# EAGLE design senseBox-MCU_mini_v11 (EAGLE 7.7.0)

## Sheet 1 of 3
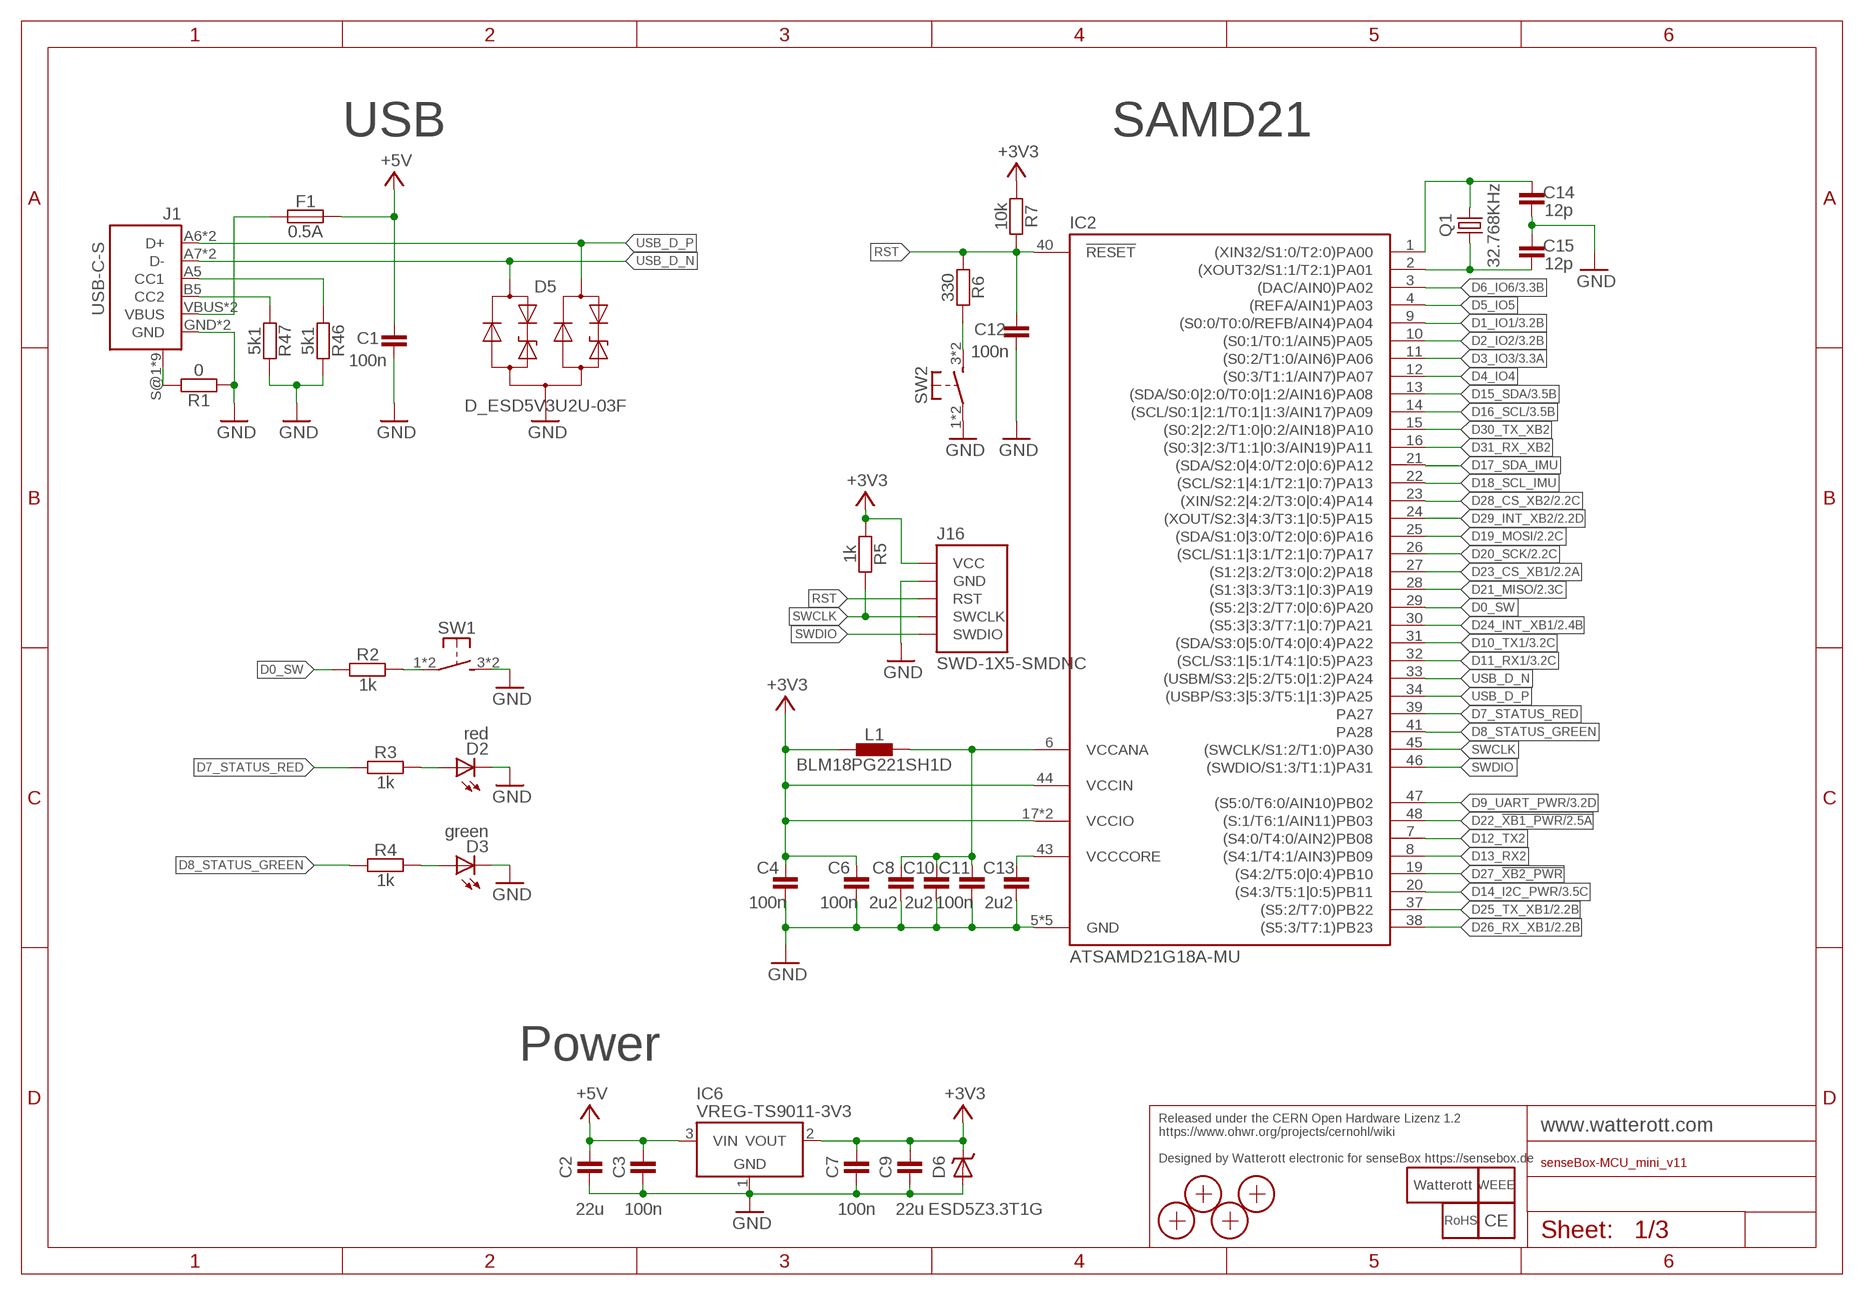
[diagram p0: schematic, sheet 1]

### Parts
C1  100n  CAPACITOR-0402  [C0402]
C2  22u  CAPACITOR-0805  [C0805]
C3  100n  CAPACITOR-0402  [C0402]
C4  100n  CAPACITOR-0402  [C0402]
C6  100n  CAPACITOR-0402  [C0402]
C7  100n  CAPACITOR-0402  [C0402]
C8  2u2  CAPACITOR-0402  [C0402]
C9  22u  CAPACITOR-0805  [C0805]
C10  2u2  CAPACITOR-0402  [C0402]
C11  100n  CAPACITOR-0402  [C0402]
C12  100n  CAPACITOR-0402  [C0402]
C13  2u2  CAPACITOR-0402  [C0402]
C14  12p  CAPACITOR-0402  [C0402]
C15  12p  CAPACITOR-0402  [C0402]
D2  red  LED-0603  [C0603]
D3  green  LED-0603  [C0603]
D5  D_ESD5V3U2U-03F  [SOT723]
D6  ESD5Z3.3T1G  D_TVS-SOD523  [SOD523]
F1  0.5A  FUSE-0805  [C0805]
IC2  ATSAMD21G18A-MU  [QFN48-PAD]
IC6  VREG-TS9011-3V3  [SOT23]
J1  USB-C-S  [USB-C-S]
J16  SWD-1X5-SMDNC  [SWD-1X5_SMDNC]
L1  BLM18PG221SH1D  INDUCTOR-0603  [C0603]
LOGO4  LOGO_SPARK-4  [SPARK_4MM]
LOGO5  LOGO_ROHS-2  [ROHS_2MM]
LOGO6  LOGO_WEEE-4  [WEEE_4MM]
LOGO7  LOGO_CE-2  [CE_2MM]
Q1  32.768KHz  CRYSTAL-ZM315  [CRYSTAL_ZM315]
R1  0  RESISTOR-0402  [C0402]
R2  1k  RESISTOR-0402  [C0402]
R3  1k  RESISTOR-0402  [C0402]
R4  1k  RESISTOR-0402  [C0402]
R5  1k  RESISTOR-0402  [C0402]
R6  330  RESISTOR-0402  [C0402]
R7  10k  RESISTOR-0402  [C0402]
R46  5k1  RESISTOR-0402  [C0402]
R47  5k1  RESISTOR-0402  [C0402]
SW1  PTS645SH50SMTR92-Grey  SW-TACTILE-PTS840P  [PTS840P]
SW2  PTS645SK50SMTR92-Red  SW-TACTILE-PTS840P  [PTS840P]
X1  PASSER-07  [PASSER_07MM]
X2  PASSER-07  [PASSER_07MM]
X3  PASSER-07  [PASSER_07MM]
X4  PASSER-07  [PASSER_07MM]

### Nets
+3V3: C4.2 C6.2 C7.2 C9.2 D6.C IC2.17(VCCIO) IC2.36(VCCIO) IC2.44(VCCIN) IC6.2(VOUT) J16.1-VCC(VCC) L1.1 R5.1 R7.1 ; also sheet 2,3
+5V: C1.2 C2.2 C3.2 F1.2 IC6.3(VIN) ; also sheet 3
CC1: J1.A5(CC1) R46.1
CC2: J1.B5(CC2) R47.1
D0_SW: IC2.29((S5:2|3:2/T7:0|0:6)PA20) R2.1
D1_IO1: IC2.9((S0:0/T0:0/REFB/AIN4)PA04) ; also sheet 3
D2_IO2: IC2.10((S0:1/T0:1/AIN5)PA05) ; also sheet 3
D3_IO3: IC2.11((S0:2/T1:0/AIN6)PA06) ; also sheet 3
D4_IO4: IC2.12((S0:3/T1:1/AIN7)PA07)
D5_IO5: IC2.4((REFA/AIN1)PA03)
D6_IO6: IC2.3((DAC/AIN0)PA02) ; also sheet 3
D7_STATUS_RED: IC2.39(PA27) R3.1
D8_STATUS_GREEN: IC2.41(PA28) R4.1
D9_UART_PWR: IC2.47((S5:0/T6:0/AIN10)PB02) ; also sheet 3
D10_TX1: IC2.31((SDA/S3:0|5:0/T4:0|0:4)PA22) ; also sheet 3
D11_RX1: IC2.32((SCL/S3:1|5:1/T4:1|0:5)PA23) ; also sheet 3
D12_TX2: IC2.7((S4:0/T4:0/AIN2)PB08)
D13_RX2: IC2.8((S4:1/T4:1/AIN3)PB09)
D14_I2C_PWR: IC2.20((S4:3/T5:1|0:5)PB11) ; also sheet 3
D15_SDA: IC2.13((SDA/S0:0|2:0/T0:0|1:2/AIN16)PA08) ; also sheet 3
D16_SCL: IC2.14((SCL/S0:1|2:1/T0:1|1:3/AIN17)PA09) ; also sheet 3
D17_SDA_IMU: IC2.21((SDA/S2:0|4:0/T2:0|0:6)PA12)
D18_SCL_IMU: IC2.22((SCL/S2:1|4:1/T2:1|0:7)PA13)
D19_MOSI: IC2.25((SDA/S1:0|3:0/T2:0|0:6)PA16) ; also sheet 2
D20_SCK: IC2.26((SCL/S1:1|3:1/T2:1|0:7)PA17) ; also sheet 2
D21_MISO: IC2.28((S1:3|3:3/T3:1|0:3)PA19) ; also sheet 2
D22_!XB1_PWR: IC2.48((S:1/T6:1/AIN11)PB03) ; also sheet 2
D23_CS_XB1: IC2.27((S1:2|3:2/T3:0|0:2)PA18) ; also sheet 2
D24_INT_XB1: IC2.30((S5:3|3:3/T7:1|0:7)PA21) ; also sheet 2
D25_TX_XB1: IC2.37((S5:2/T7:0)PB22) ; also sheet 2
D26_RX_XB1: IC2.38((S5:3/T7:1)PB23) ; also sheet 2
D27_!XB2_PWR: IC2.19((S4:2/T5:0|0:4)PB10)
D28_CS_XB2: IC2.23((XIN/S2:2|4:2/T3:0|0:4)PA14) ; also sheet 2
D29_INT_XB2: IC2.24((XOUT/S2:3|4:3/T3:1|0:5)PA15) ; also sheet 2
D30_TX_XB2: IC2.15((S0:2|2:2/T1:0|0:2/AIN18)PA10)
D31_RX_XB2: IC2.16((S0:3|2:3/T1:1|0:3/AIN19)PA11)
GND: C1.1 C2.1 C3.1 C4.1 C6.1 C7.1 C8.1 C9.1 C10.1 C11.1 C12.1 C13.1 C14.2 C15.1 D2.C D3.C D5.3(A) D6.A IC2.5(GND) IC2.18(GND) IC2.35(GND) IC2.42(GND) IC2.TP(GND) IC6.1(GND) J1.GND J1.GND2(GND) J16.2-GND(GND) R1.1 R46.2 R47.2 SW1.3(S1) SW1.4(S1) SW2.1 SW2.2(P1) ; also sheet 2,3
N$1: C14.1 IC2.1((XIN32/S1:0/T2:0)PA00) Q1.2
N$2: C15.2 IC2.2((XOUT32/S1:1/T2:1)PA01) Q1.1
N$3: D2.A R3.2
N$12: D3.A R4.2
N$13: R6.2 SW2.3(S1) SW2.4(S1)
RST: C12.2 IC2.40(!RESET) J16.3-RST(RST) R6.1 R7.2
SHLD: J1.S@1(SHIELD) J1.S@2(SHIELD) J1.S@3(SHIELD) J1.S@4(SHIELD) J1.S@5(SHIELD) J1.S@6(SHIELD) J1.S@7(SHIELD) J1.S@8(SHIELD) J1.S@9(SHIELD) R1.2
SW: R2.2 SW1.1 SW1.2(P1)
SWCLK: IC2.45((SWCLK/S1:2/T1:0)PA30) J16.4-SWDCLK(SWCLK) R5.2
SWDIO: IC2.46((SWDIO/S1:3/T1:1)PA31) J16.5-SWDIO(SWDIO)
USB_D_N [USB]: D5.1(C1) IC2.33((USBM/S3:2|5:2/T5:0|1:2)PA24) J1.A7(D-) J1.B7(D-)
USB_D_P [USB]: D5.2(C2) IC2.34((USBP/S3:3|5:3/T5:1|1:3)PA25) J1.A6(D+) J1.B6(D+)
VBUS: F1.1 J1.VBUS J1.VBUS2(VBUS)
VCCANA: C8.2 C10.2 C11.2 IC2.6(VCCANA) L1.2
VCCCORE: C13.2 IC2.43(VCCCORE)

### Notes on the sheet
- USB | SAMD21
- Power
- Released under the CERN Open Hardware Lizenz 1.2
  https://www.ohwr.org/projects/cernohl/wiki
  
  Designed by Watterott electronic for senseBox https://sensebox.de

## Sheet 2 of 3
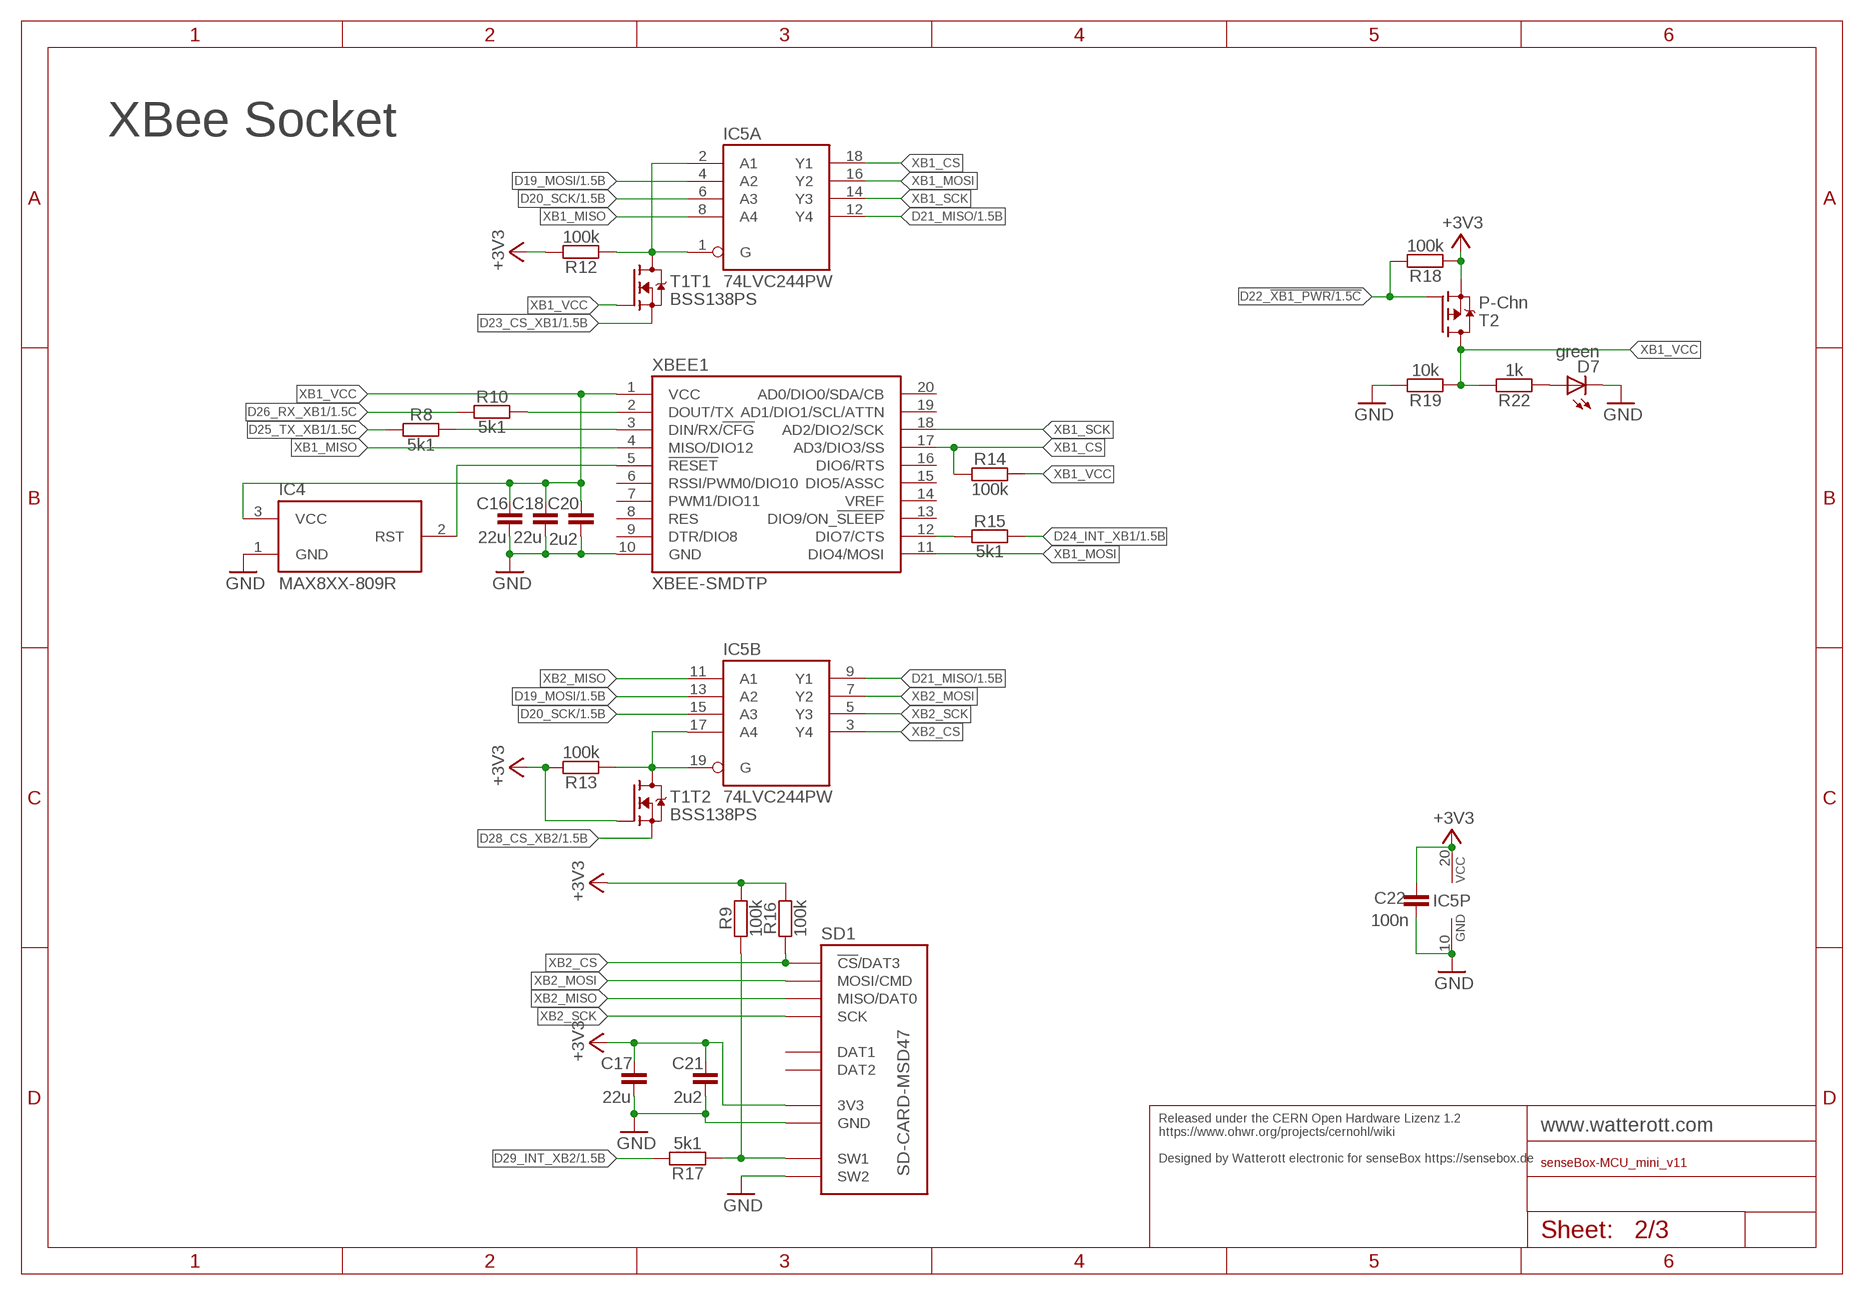
[diagram p1: schematic, sheet 2]

### Parts
C16  22u  CAPACITOR-0805  [C0805]
C17  22u  CAPACITOR-0805  [C0805]
C18  22u  CAPACITOR-0805  [C0805]
C20  2u2  CAPACITOR-0402  [C0402]
C21  2u2  CAPACITOR-0402  [C0402]
C22  100n  CAPACITOR-0402  [C0402]
D7  green  LED-0603  [C0603]
IC4  MAX8XX-809R  [SOT23]
IC5  74LVC244PW  [TSSOP20]
R8  5k1  RESISTOR-0402  [C0402]
R9  100k  RESISTOR-0402  [C0402]
R10  5k1  RESISTOR-0402  [C0402]
R12  100k  RESISTOR-0402  [C0402]
R13  100k  RESISTOR-0402  [C0402]
R14  100k  RESISTOR-0402  [C0402]
R15  5k1  RESISTOR-0402  [C0402]
R16  100k  RESISTOR-0402  [C0402]
R17  5k1  RESISTOR-0402  [C0402]
R18  100k  RESISTOR-0402  [C0402]
R19  10k  RESISTOR-0402  [C0402]
R22  1k  RESISTOR-0402  [C0402]
SD1  SD-CARD-MSD47  [SD_47309XXXX]
T1  BSS138PS  [SOT363]
T2  P-Chn  MOSFET-P-SOT23  [SOT23]
XBEE1  XBEE-SMDTP  [XBEE_SMD_TP]

### Nets
+3V3: C17.2 C21.2 C22.2 IC5.20(P:VCC) R9.2 R12.2 R13.2 R16.2 R18.1 SD1.VCC(3V3) T1.5(T2:G) T2.2(S) ; also sheet 1,3
D19_MOSI: IC5.4(A:A2) IC5.13(B:A2) ; also sheet 1
D20_SCK: IC5.6(A:A3) IC5.15(B:A3) ; also sheet 1
D21_MISO: IC5.9(B:Y1) IC5.12(A:Y4) ; also sheet 1
D22_!XB1_PWR: R18.2 T2.1(G) ; also sheet 1
D23_CS_XB1: T1.1(T1:S) ; also sheet 1
D24_INT_XB1: R15.2 ; also sheet 1
D25_TX_XB1: R8.1 ; also sheet 1
D26_RX_XB1: R10.1 ; also sheet 1
D28_CS_XB2: T1.4(T2:S) ; also sheet 1
D29_INT_XB2: R17.2 ; also sheet 1
GND: C16.1 C17.1 C18.1 C20.1 C21.1 C22.1 D7.C IC4.1(GND) IC5.10(P:GND) R19.2 SD1.GND SD1.GND@1(GND) SD1.GND@2(GND) SD1.SW2 XBEE1.10(GND) ; also sheet 1,3
MCU_CS_XBEE1: IC5.1(A:G) IC5.2(A:A1) R12.1 T1.6(T1:D)
MCU_CS_XBEE2: IC5.17(B:A4) IC5.19(B:G) R13.1 T1.3(T2:D)
N$4: R9.1 R17.1 SD1.SW1
N$5: D7.A R22.1
RST_XB1: IC4.2(RST) XBEE1.5(!RESET!)
XB1_CS: IC5.18(A:Y1) R14.1 XBEE1.17(AD3/DIO3/SS)
XB1_MISO: IC5.8(A:A4) XBEE1.4(MISO/DIO12)
XB1_MOSI: IC5.16(A:Y2) XBEE1.11(DIO4/MOSI)
XB1_RX: R8.2 XBEE1.3(DIN/RX/!CFG!)
XB1_SCK: IC5.14(A:Y3) XBEE1.18(AD2/DIO2/SCK)
XB1_TX: R10.2 XBEE1.2(DOUT/TX)
XB1_VCC: C16.2 C18.2 C20.2 IC4.3(VCC) R14.2 R19.1 R22.2 T1.2(T1:G) T2.3(D) XBEE1.1(VCC)
XB2_CS: IC5.3(B:Y4) R16.1 SD1.CS(!CS!/DAT3)
XB2_MISO: IC5.11(B:A1) SD1.MISO(MISO/DAT0)
XB2_MOSI: IC5.7(B:Y2) SD1.MOSI(MOSI/CMD)
XB2_SCK: IC5.5(B:Y3) SD1.SCK
XBEE1_CTS/IRQ: R15.1 XBEE1.12(DIO7/CTS)
Unconnected: SD1.DAT1 SD1.DAT2 XBEE1.6(RSSI/PWM0/DIO10) XBEE1.7(PWM1/DIO11) XBEE1.8(RES) XBEE1.9(DTR/DIO8) XBEE1.13(DIO9/ON_!SLEEP!) XBEE1.14(VREF) XBEE1.15(DIO5/ASSC) XBEE1.16(DIO6/RTS) XBEE1.19(AD1/DIO1/SCL/ATTN) XBEE1.20(AD0/DIO0/SDA/CB)

### Notes on the sheet
- XBee Socket
- Released under the CERN Open Hardware Lizenz 1.2
  https://www.ohwr.org/projects/cernohl/wiki
  
  Designed by Watterott electronic for senseBox https://sensebox.de

## Sheet 3 of 3
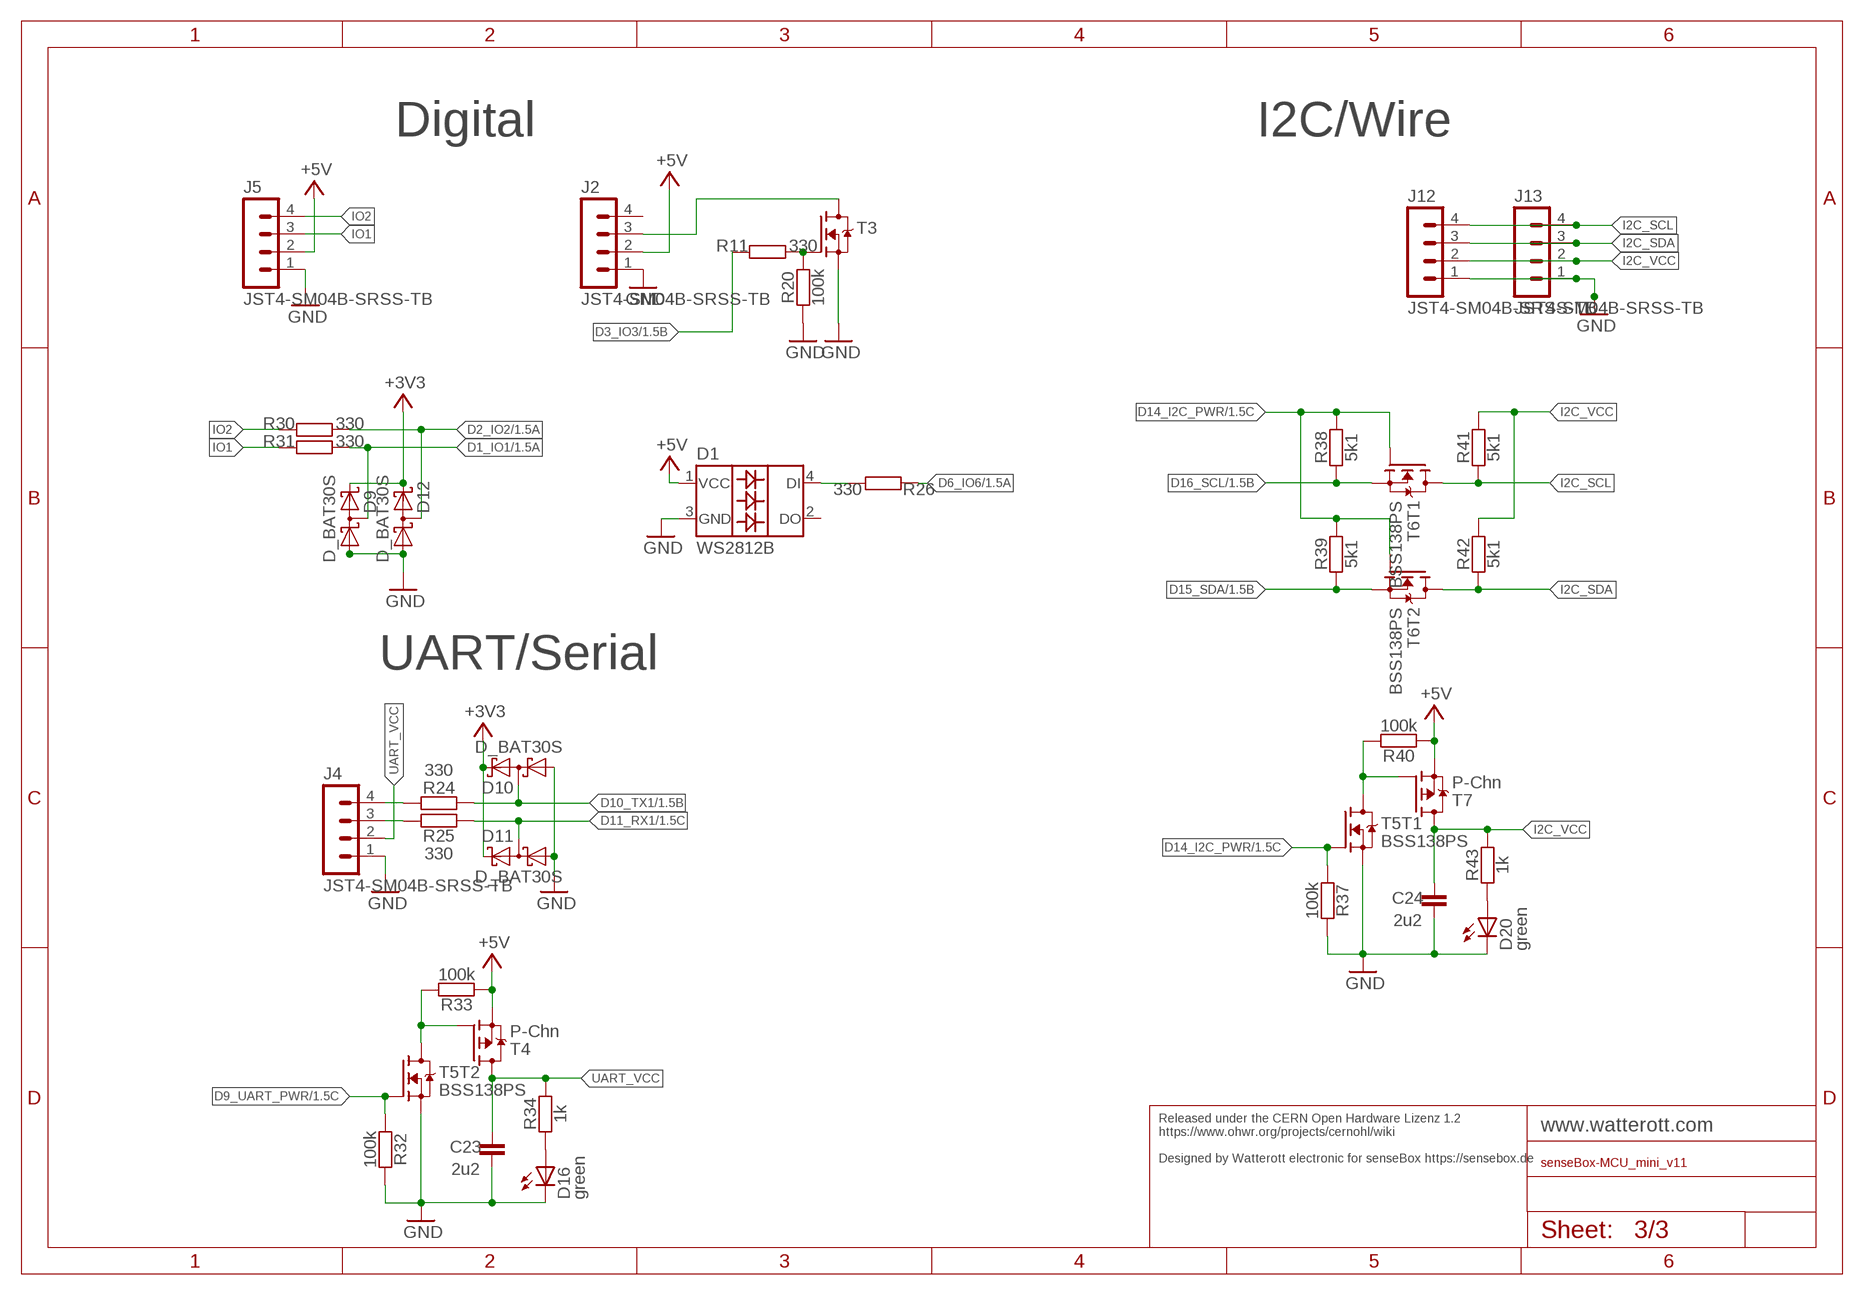
[diagram p2: schematic, sheet 3]

### Parts
C23  2u2  CAPACITOR-0402  [C0402]
C24  2u2  CAPACITOR-0402  [C0402]
D1  WS2812B  [WS2812B]
D9  D_BAT30S  [SOT323]
D10  D_BAT30S  [SOT323]
D11  D_BAT30S  [SOT323]
D12  D_BAT30S  [SOT323]
D16  green  LED-0603  [C0603]
D20  green  LED-0603  [C0603]
J2  JST4-SM04B-SRSS-TB  [JST_SM04B-SRSS-TB]
J4  JST4-SM04B-SRSS-TB  [JST_SM04B-SRSS-TB]
J5  JST4-SM04B-SRSS-TB  [JST_SM04B-SRSS-TB]
J12  JST4-SM04B-SRSS-TB  [JST_SM04B-SRSS-TB]
J13  JST4-SM04B-SRSS-TB  [JST_SM04B-SRSS-TB]
R11  330  RESISTOR-0402  [C0402]
R20  100k  RESISTOR-0402  [C0402]
R24  330  RESISTOR-0402  [C0402]
R25  330  RESISTOR-0402  [C0402]
R26  330  RESISTOR-0402  [C0402]
R30  330  RESISTOR-0402  [C0402]
R31  330  RESISTOR-0402  [C0402]
R32  100k  RESISTOR-0402  [C0402]
R33  100k  RESISTOR-0402  [C0402]
R34  1k  RESISTOR-0402  [C0402]
R37  100k  RESISTOR-0402  [C0402]
R38  5k1  RESISTOR-0402  [C0402]
R39  5k1  RESISTOR-0402  [C0402]
R40  100k  RESISTOR-0402  [C0402]
R41  5k1  RESISTOR-0402  [C0402]
R42  5k1  RESISTOR-0402  [C0402]
R43  1k  RESISTOR-0402  [C0402]
T3  MOSFET-N-SOT23  [SOT23]
T4  P-Chn  MOSFET-P-SOT23  [SOT23]
T5  BSS138PS  [SOT363]
T6  BSS138PS  [SOT363]
T7  P-Chn  MOSFET-P-SOT23  [SOT23]

### Nets
!I2C_POWER: R40.2 T5.6(T1:D) T7.1(G)
!UART_POWER: R33.2 T4.1(G) T5.3(T2:D)
+3V3: D9.2(C) D10.2(C) D11.2(C) D12.2(C) ; also sheet 1,2
+5V: D1.1(VCC) J2.2 J5.2 R33.1 R40.1 T4.2(S) T7.2(S) ; also sheet 1
D1_IO1: D9.3(CA) R31.1 ; also sheet 1
D2_IO2: D12.3(CA) R30.1 ; also sheet 1
D3_IO3: R11.2 ; also sheet 1
D6_IO6: R26.2 ; also sheet 1
D9_UART_PWR: R32.1 T5.5(T2:G) ; also sheet 1
D10_TX1: D10.3(CA) R24.1 ; also sheet 1
D11_RX1: D11.3(CA) R25.1 ; also sheet 1
D14_I2C_PWR: R37.1 R38.2 R39.2 T5.2(T1:G) T6.2(T1:G) T6.5(T2:G) ; also sheet 1
D15_SDA: R39.1 T6.4(T2:S) ; also sheet 1
D16_SCL: R38.1 T6.1(T1:S) ; also sheet 1
GND: C23.1 C24.1 D1.3(GND) D9.1(A) D10.1(A) D11.1(A) D12.1(A) D16.C D20.C J2.1 J4.1 J5.1 J12.1 J13.1 R20.1 R32.2 R37.2 T3.2(S) T5.1(T1:S) T5.4(T2:S) ; also sheet 1,2
I2C_SCL: J12.4 J13.4 R41.1 T6.6(T1:D)
I2C_SDA: J12.3 J13.3 R42.1 T6.3(T2:D)
I2C_VCC: C24.2 J12.2 J13.2 R41.2 R42.2 R43.2 T7.3(D)
IO1: J5.3 R31.2
IO2: J5.4 R30.2
N$6: D1.4(DI) R26.1
N$7: J2.3 T3.3(D)
N$8: D20.A R43.1
N$9: D16.A R34.1
SW_FAN: R11.1 R20.2 T3.1(G)
UART_RX1: J4.3 R25.2
UART_TX1: J4.4 R24.2
UART_VCC: C23.2 J4.2 R34.2 T4.3(D)
Unconnected: D1.2(DO) J2.4

### Notes on the sheet
- Digital | I2C/Wire
- UART/Serial
- Released under the CERN Open Hardware Lizenz 1.2
  https://www.ohwr.org/projects/cernohl/wiki
  
  Designed by Watterott electronic for senseBox https://sensebox.de

## Library data of the parts
C1-C4 C6-C18 C20-C24 = we-rcl:CAPACITOR: Capacitor ...2.2uF @ 6.3V -> 0402 ...4.7uF @ 6.3V -> 0603 ...10uF @ 16V -> 0805 ...22uF @ 25V -> 1206
D1 = we-opto:WS2812B: WS2812 RGB LED (built-in driver)
D2 D3 D7 D16 D20 = we-opto:LED: LED red, green, blue -> 0603
D5 = we-rcl:D_ESD5V3U2U: ESD5V3U2U TVS Diode (Uni-directional Ultra Low ESD) Vrwm=5.3V, 0.4pF@1MHz; DIGIKEY: ESD5V3U2U-03F H6327DKR-ND
D6 = we-rcl:D_TVS: TVS Diode
D9-D12 = we-rcl:D_BAT30S: BAT30 Diode Array (1x series Schottky) If=300mA, Vf=0.5V, Vr=30V, 22pF@1MHz
F1 = we-rcl:FUSE: Fuse Polyfuses 0805 - 0.5A or 1A, 6V 1206 - 2A, 6V 1812 - 1A or 2A, 16V
IC2 = we-chip:ATSAMD21G: Microchip ATSAMD21Gxx ARM Cortex-M0+ (48 pin) ...18 - 256kb Flash 32kb RAM ...17 - 128kb Flash 16kb RAM ...16 - 64kb Flash 8kb RAM ...15 - 32kb Flash 4kb RAM
IC4 = we-chip:MAX8XX: MAX8xx / STM8xx / TCM8xx Reset Monitor Reset Time: mind. 140ms, typ. 320ms, max. 560ms 803 - Active-Low, Open-Drain 809 - Active-Low, Push-Pull 810 - Active-High, Push-Pull ...Z - 2.3V ...R - 2.6V ...S - 2.9V ...T - 3.1V ...J - 4.0V ...M - 4.4V ...L - 4.6V
IC5 = we-chip:74*244: 74*244 Octal Buffer / Line Driver (3-State) HC - VCC: 2-5.5V - Input: High 2.1V @ 3V / 3.5V @ 5V AHC - VCC: 2-5.5V - Input: 5V tolerant, High 2.1V @ 3V / 3.5V @ 5V HCT - VCC: 4.5-5.5V - Input: High 2V @ 5V AHCT - VCC: 4.5-5.5V - Input: High 2V @ 5V LVC - VCC: 1.65-3.6V - Input: 5V tolerant, High 2V @ 3V; DIGIKEY: 568-1583-2-ND
IC6 = we-power:VREG: Voltage Regulator LDOs Taiwan Semi TS1117 800mA max 15V - compatible On Semi NCP1117 1A max 20V - compatible Diodes AP2111H 0.6A max 6V (0.25V@0.6A) - compatible Diodes AP2114H 1A max 6V (0.45V@1A) Taiwan Semi TS9011 250mA max 12V - compatible Diodes AP2210 300mA max 15V - compatible Microchip MCP1700 250mA max 6.5V - compatible Microchip MCP1702 250mA max 13V - compatible Microchip MCP1703 250mA max 16V - compatible Microchip MCP1754 150mA max 16V Taiwan Semi TS5204 80mA max 16V (low noise) DC/DC Converter Modules Recom R-78Ex.x-1.0-W36 1A max 28V - compatible CUI V78xx-2000 2A max 18V Murata OKI-78SR-x.x/1.5-W36 1.5A max 36V
J1 = we-con:USB-C: USB-C Connector Hroparts TYPE-C-31-M-12 or Jing C167321 or XKB U262-161N-4BVC11 Up: XKB U263-241N-4BQC11-1 or Wuerth 632722110112
J2 J4 J5 J12 J13 = we-con:JST4: JST Connector
J16 = we-board@1:SWD: SWD connector
L1 = we-rcl:INDUCTOR: Inductor Ferrite Bead - Murata BLM18PG 0603 3.0A 33Ohm @ 100MH -> BLM18PG330SN1D 0603 2.0A 120Ohm @ 100MH -> BLM18PG121SN1D 0603 1.4A 220Ohm @ 100MH -> BLM18PG221SH1D 0603 1.2A 330Ohm @ 100MH -> BLM18PG331SN1D 0603 1.0A 470Ohm @ 100MH -> BLM18PG471SN1D
LOGO4 = we-symbol:LOGO_SPARK: Watterott electronic Logo
LOGO5 = we-symbol:LOGO_ROHS: RoHS Logo
LOGO6 = we-symbol:LOGO_WEEE: WEEE Logo
LOGO7 = we-symbol:LOGO_CE: CE Logo
Q1 = we-rcl:CRYSTAL: Crystal
R1-R20 R22 R24-R26 R30-R34 R37-R43 R46 R47 = we-rcl:RESISTOR: Resistor all kinds in 0402 and 0603
SD1 = we-con@1:SD-CARD: SD-Card Socket
SW1 SW2 = we-switch:SW-TACTILE: Tactile Switche; DIGIKEY: CKN10511DKR-ND
T1 T5 T6 = we-transistor:BSS138PS: BSS138 Dual N-Chn MOSFET (Vgs>=+/-20V, Vds>=40V, Id>=0.2A + Rds<=3Ohm @ Vgs=4.5V) BSS138PS compatible: 2N7002PS, Si1926DL, BSS138BKS (with ESD protection)
T2 T4 T7 = we-transistor:MOSFET-P: P-Chn MOSFET SOT23 P-Chn MOSFET TSM3401 (Vgs>=+/-20V, Vds>=30V, Id>=2A + Rds<=0.1Ohm @ Vgs=4.5V)
T3 = we-transistor@1:MOSFET-N: N-Chn MOSFET SOT23 N-Chn MOSFET TSM3404, TSM240N03 (Vgs>=+/-20V, Vds>=30V, Id>=3A + Rds<=0.05Ohm @ Vgs=4.5V) BSS138 (Vgs>=+/-20V, Vds>=40V, Id>=0.2A + Rds<=3Ohm @ Vgs=4.5V) SOT223 Low Side Switch with Protection (Infineon) BSP76 (Vin=0...10V, Vds=42V, Id=1.4A + Rds=0.2Ohm @ Vin=5V) BSP77 (Vin=0...10V, Vds=42V, Id=2.2A + Rds=0.1Ohm @ Vin=5V) D²Pak Low Side Switch with Protection (Infineon) BTS117TC (Vin=0...10V, Vds=60V, Id=3.5A + Rds=0.12Ohm @ Vin=5V) BTS133TC (Vin=0...10V, Vds=60V, Id=7A + Rds=0.06Ohm @ Vin=5V) BTS141TC (Vin=0...10V, Vds=60V, Id=12A + Rds=0.03Ohm @ Vin=5V) BTS3018TC (Vin=0...10V, Vds=60V, Id=6A + Rds=0.02Ohm @ Vin=5V)
X1-X4 = we-symbol:PASSER: Fiducial Marker
XBEE1 = we-board:XBEE: XBEE connector

## Net classes
1 USB: width 0.18 mm, clearance 0.18 mm

## Board
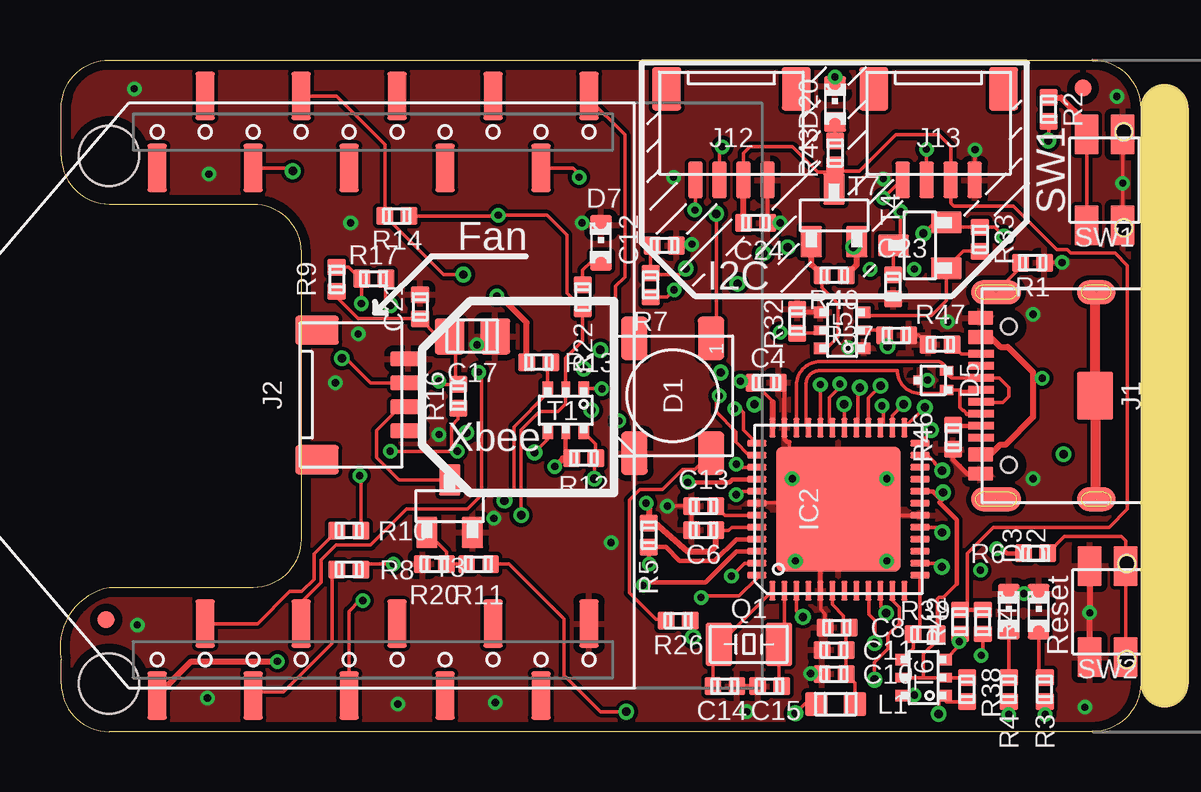
[diagram p3: board, top side]
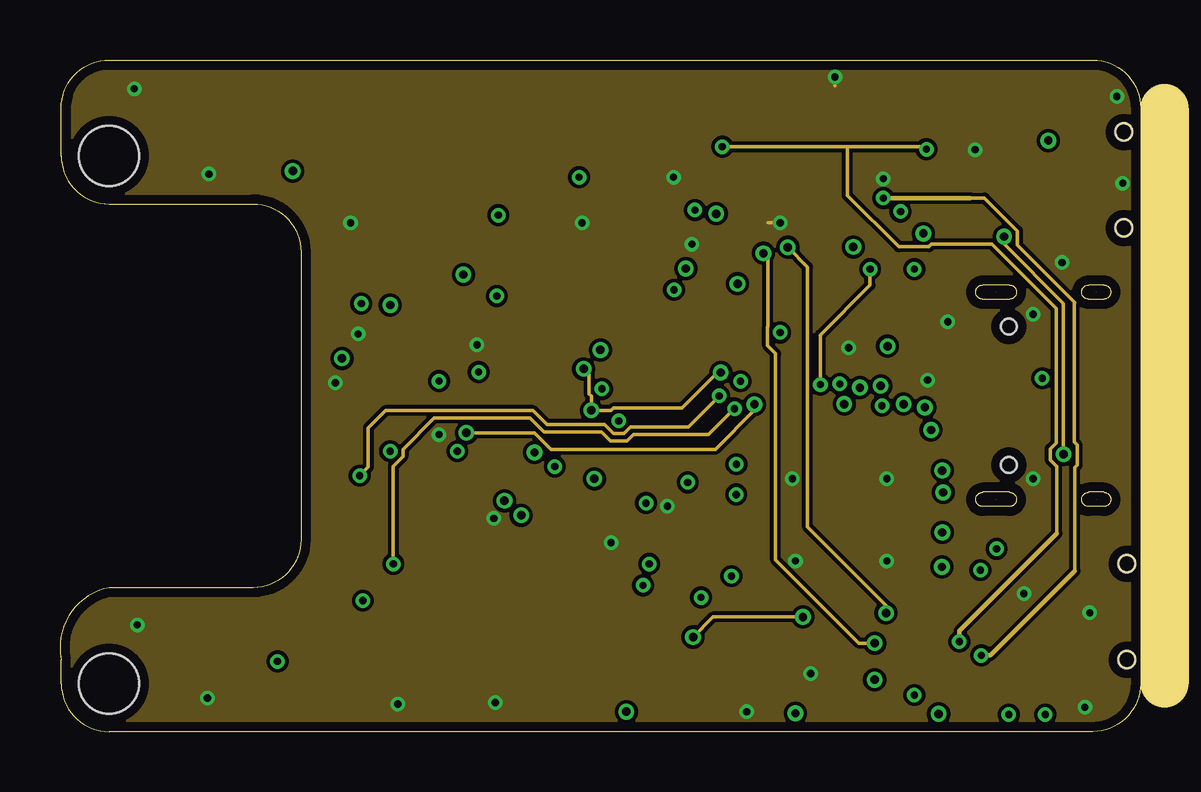
[diagram p4: board, inner layer Route2]
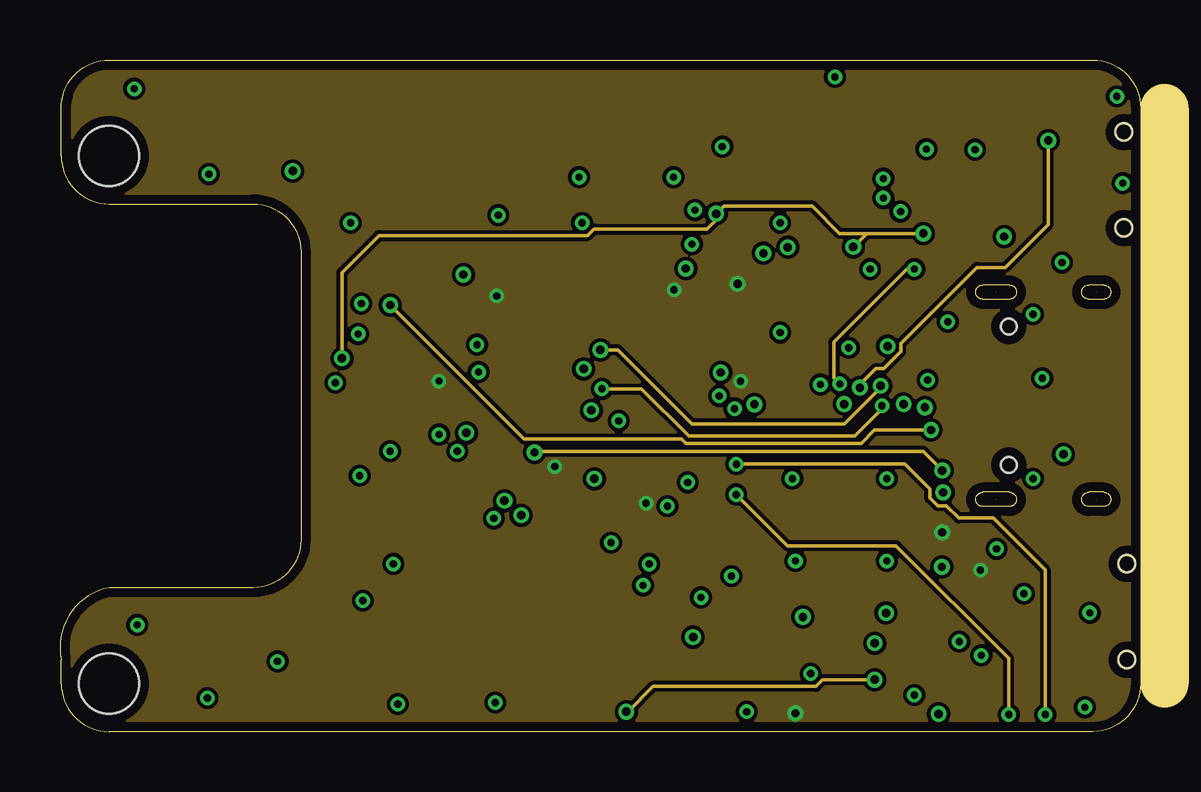
[diagram p5: board, inner layer Route15]
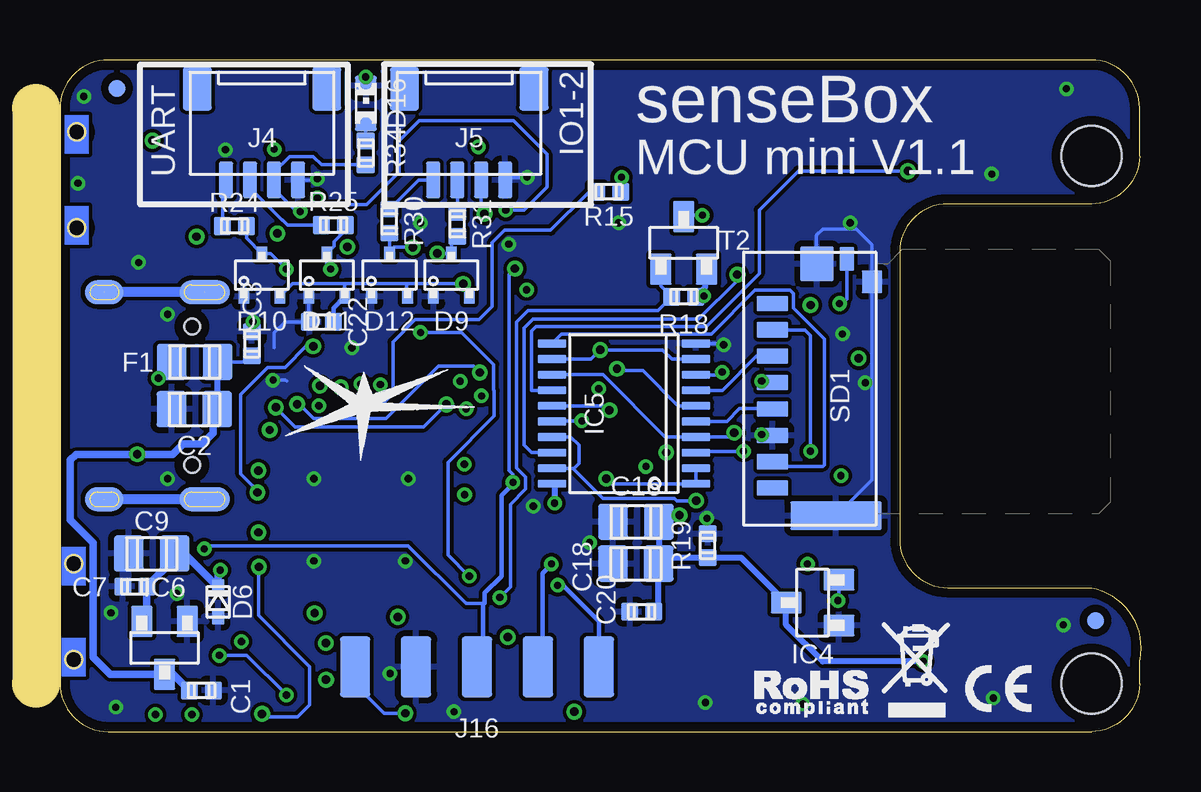
[diagram p6: board, bottom side, seen from below]

Size 45.05 x 28 mm. Coordinates in mm from the lower left corner, seen from the top.
Outline: 0.05,2 arc90 2.05,0 43.05,0 arc90 45.05,2 45.05,26 arc90 43.05,28 2.05,28 arc90 0.05,26 0.05,24 arc90 2.05,22 8.05,22 arc-90 10.05,20 10.05,8 arc-90 8.05,6 2.05,6 arc90 0.05,3 0.05,2
Copper layers (1+2*15+16): Top 0.035mm / dielectric 0.35mm / Route2 0.035mm / dielectric 0.76mm / Route15 0.035mm / dielectric 0.35mm / Bottom 0.035mm
Design rules "we-dru-4-layer": minimum track width 6mil, minimum drill 0.3mm, track to track 6mil, track to pad 6mil, pad to pad 8mil, via to via 8mil, smd to smd 4mil, copper to edge 0.4mm, drill to drill 0.4mm, minimum pad ring 6mil, minimum via ring 6mil, stop-mask expansion 0.1mm, vias tented up to drill 0.5mm, thermal gap 0.25mm
Holes 2.5 mm at 2.05,2 2.05,24
Milling: 1 lines

### Footprints (pad centres in the part's own frame; a part is rotated, then mirrored left to right if it is on the bottom)
C0402 = smd 0.75 x 0.7: 1 0,0.5; 2 0,-0.5
C0805 = smd 1.5 x 1.25: 1 0,0.95; 2 0,-0.95
WS2812B = smd 1.8 x 1.1: 1 -2.4,1.6; 2 -2.4,-1.6; 3 2.4,-1.6; 4 2.4,1.6
C0603 = smd 0.9 x 0.8: A 0,-0.75; C 0,0.75
SOT723 = smd 0.6 x 0.4: 1 -0.55,0.4; 2 -0.55,-0.4; 3 0.55,0
SOD523 = smd 0.5 x 0.7: A 0,-0.6; C 0,0.6
SOT323 = smd 0.6 x 0.5: 1 -0.9,0.75; 2 -0.9,-0.75; 3 0.9,0
QFN48-PAD = smd 0.8 x 0.26: 1 -3.4,2.75; 2 -3.4,2.25; 3 -3.4,1.75; 4 -3.4,1.25; 5 -3.4,0.75; 6 -3.4,0.25; 7 -3.4,-0.25; 8 -3.4,-0.75; 9 -3.4,-1.25; 10 -3.4,-1.75; 11 -3.4,-2.25; 12 -3.4,-2.75; 25 3.4,-2.75; 26 3.4,-2.25; 27 3.4,-1.75; 28 3.4,-1.25; 29 3.4,-0.75; 30 3.4,-0.25; 31 3.4,0.25; 32 3.4,0.75; 33 3.4,1.25; 34 3.4,1.75; 35 3.4,2.25; 36 3.4,2.75 | smd 0.26 x 0.8: 13 -2.75,-3.4; 14 -2.25,-3.4; 15 -1.75,-3.4; 16 -1.25,-3.4; 17 -0.75,-3.4; 18 -0.25,-3.4; 19 0.25,-3.4; 20 0.75,-3.4; 21 1.25,-3.4; 22 1.75,-3.4; 23 2.25,-3.4; 24 2.75,-3.4; 37 2.75,3.4; 38 2.25,3.4; 39 1.75,3.4; 40 1.25,3.4; 41 0.75,3.4; 42 0.25,3.4; 43 -0.25,3.4; 44 -0.75,3.4; 45 -1.25,3.4; 46 -1.75,3.4; 47 -2.25,3.4; 48 -2.75,3.4 | smd 5.2 x 5.2: TP 0,0
SOT23 = smd 1.3 x 0.9: 1 -1.1,0.95; 2 -1.1,-0.95; 3 1.1,0
TSSOP20 = smd 1.2 x 0.35: 1 -3,2.925; 2 -3,2.275; 3 -3,1.625; 4 -3,0.975; 5 -3,0.325; 6 -3,-0.325; 7 -3,-0.975; 8 -3,-1.625; 9 -3,-2.275; 10 -3,-2.925; 11 3,-2.925; 12 3,-2.275; 13 3,-1.625; 14 3,-0.975; 15 3,-0.325; 16 3,0.325; 17 3,0.975; 18 3,1.625; 19 3,2.275; 20 3,2.925
USB-C-S = smd 1.1 x 0.3: A5 -1.155,-1.25; A6 -1.155,-0.25; A7 -1.155,0.25; A8 -1.155,1.25; B5 -1.155,1.75; B6 -1.155,0.75; B7 -1.155,-0.75; B8 -1.155,-1.75 | smd 1.05 x 0.6: GND -1.175,3.25; GND2 -1.175,-3.25; VBUS -1.175,2.45; VBUS2 -1.175,-2.45 | smd 2.1 x 1: S@1 -0.53,4.32; S@5 -0.53,-4.32 | smd 2.1 x 1 bottom: S@2 -0.53,4.32; S@6 -0.53,-4.32 | smd 1.6 x 1: S@3 3.65,4.32; S@7 3.65,-4.32 | smd 1.6 x 1 bottom: S@4 3.65,4.32; S@8 3.65,-4.32 | smd 1.5 x 2: S@9 3.6,0 | hole 0.65: 0,-2.89; 0,2.89
JST_SM04B-SRSS-TB = smd 1.5 x 0.6: 1 2.4,1.5; 2 2.4,0.5; 3 2.4,-0.5; 4 2.4,-1.5 | smd 1.8 x 1.2: SHLD1 -1.4,-2.7; SHLD2 -1.4,2.7
SWD-1X5_SMDNC = smd 2.54 x 1.27: 1-VCC 0,5.08; 2-GND 0,2.54; 3-RST 0,0; 4-SWDCLK 0,-2.54; 5-SWDIO 0,-5.08
C0603' = smd 1 x 0.95: 1 0,0.8; 2 0,-0.8
CRYSTAL_ZM315 = smd 1.8 x 1.1: 1 0,1.25; 2 0,-1.25
SD_47309XXXX = smd 0.65 x 1.3: CS 2.75,4.3; DAT1 -3.85,4.3; DAT2 3.85,4.3; GND -1.65,4.3; MISO -2.75,4.3; MOSI 1.65,4.3; SCK -0.55,4.3; VCC 0.55,4.3 | smd 1.2 x 3.8: GND@1 -5,1.65 | smd 1.45 x 1.4: GND@2 5.5,2.45 | smd 1 x 0.6: SW1 5.7,1.2 | smd 0.95 x 0.85: SW2 4.75,0.15
PTS840P = smd 1.65 x 1: 1 -1.9,0.75; 2 1.9,0.75; 3 -1.9,-0.75; 4 1.9,-0.75 | hole 0.7: -2,-0.8; 2,-0.8
SOT363 = smd 0.6 x 0.5: 1 -0.9,0.75; 3 -0.9,-0.75; 4 0.9,-0.75; 6 0.9,0.75 | smd 0.6 x 0.4: 2 -0.9,0; 5 0.9,0
PASSER_07MM = smd 0.7 x 0.7: X 0,0
XBEE_SMD_TP = smd 2 x 0.8: 1 -12.5,9; 2 -9.5,7; 3 -12.5,5; 4 -9.5,3; 5 -12.5,1; 6 -9.5,-1; 7 -12.5,-3; 8 -9.5,-5; 9 -12.5,-7; 10 -9.5,-9; 11 12.5,-9; 12 9.5,-7; 13 12.5,-5; 14 9.5,-3; 15 12.5,-1; 16 9.5,1; 17 12.5,3; 18 9.5,5; 19 12.5,7; 20 9.5,9

### Placement (x,y rotation side)
C1  39.16,1.71 270 bottom
C2  39.45,13.44 90 bottom
C3  37.05,16.17 0 bottom
C4  29.44,14.54 270 top
C6  26.83,8.4 90 top
C7  41.93,6.04 90 bottom
C8  32.39,4.34 90 top
C9  41.23,7.42 90 bottom
C10  32.27,2.4 90 top
C11  32.27,3.4 90 top
C12  25.19,20.26 270 top
C13  26.83,9.4 90 top
C14  27.72,1.89 90 top
C15  29.59,1.89 90 top
C16  21.04,8.75 90 bottom
C17  17.19,16.48 270 top
C18  21.05,7 90 bottom
C20  20.8,5 90 bottom
C21  15.01,17.72 0 top
C22  34.15,17.08 90 bottom
C23  34.73,18.54 180 top
C24  28.99,21.2 270 top
D1  25.54,14 270 top
D2  40.8,5 0 top
D3  39.55,5 0 top
D5  36.4,14.64 180 top
D6  38.46,5.4 0 bottom
D7  22.55,20.38 0 top
D9  28.74,19.03 90 bottom
D10  36.64,19.03 90 bottom
D11  33.93,19.03 90 bottom
D12  31.32,19.03 90 bottom
D16  32.3,26.19 0 bottom
D20  32.31,26.16 0 top
F1  39.43,15.41 90 bottom
IC2  32.45,9.27 90 top
IC4  13.67,5.38 180 bottom
IC5  21.54,13.25 180 bottom
IC6  40.69,3.49 270 bottom
J1  39.55,14 0 top
J2  12.11,14.03 0 top
J4  36.63,25.4 270 bottom
J5  27.99,25.4 270 bottom
J12  27.99,25.4 270 top
J13  36.63,25.4 270 top
J16  27.67,2.7 90 bottom
L1  BLM18PG221SH1D  [C0603']  32.33,1.15 90 top
LOGO4  32.38,13.67 0 bottom
LOGO5  13.71,1.58 0 bottom
LOGO6  9.39,2.59 0 bottom
LOGO7  5.93,1.79 0 bottom
Q1  28.72,3.64 270 top
R1  40.54,19.55 270 top
R2  41.21,25.94 180 top
R3  41.05,1.75 180 top
R4  39.55,1.75 180 top
R5  24.54,8.19 0 top
R6  40.68,7.43 90 top
R7  24.62,18.61 180 top
R8  12.05,6.75 270 top
R9  11.53,18.86 0 top
R10  12.05,8.38 270 top
R11  17.45,6.99 90 top
R12  21.83,11.39 270 top
R13  19.95,15.39 270 top
R14  14.05,21.5 90 top
R15  22.17,22.5 270 bottom
R16  16.6,13.97 180 top
R17  13.07,18.89 90 top
R18  19.05,18.13 270 bottom
R19  18.05,7.75 180 bottom
R20  15.61,6.99 90 top
R22  21.79,18.13 0 top
R24  37.78,21.07 270 bottom
R25  33.65,21.11 270 bottom
R26  25.78,4.63 90 top
R30  31.32,21.28 180 bottom
R31  28.48,21.16 180 bottom
R32  30.74,17.11 180 top
R33  38.35,20.52 0 top
R34  32.31,24.13 0 bottom
R37  34.88,16.52 90 top
R38  37.81,1.75 180 top
R39  36.06,4.06 90 top
R40  32.27,19.02 270 top
R41  38.47,4.57 180 top
R42  37.51,4.57 180 top
R43  32.31,24.13 0 top
R46  37.23,12.26 0 top
R47  36.7,16.14 270 top
SD1  11.05,14 90 bottom
SW1  43.55,23 90 top
SW2  43.67,5 90 top
T1  21.08,13.39 270 top
T2  19.05,20.38 90 bottom
T3  16.24,9.4 90 top
T4  35.85,20.27 180 top
T5  32.61,16.73 180 top
T6  36,2.25 180 top
T7  32.27,21.52 90 top
X1  1.92,4.67 0 top
X2  42.67,26.82 0 bottom
X3  1.88,4.63 0 bottom
X4  42.65,26.83 0 top
XBEE1  13.05,14 90 top

### Tracks (layer width: path | path; a pad name or v marks a point on that pad's centre or on a via)
!I2C_POWER
  Top 0.152: T5.6 31.97,15.98 32.43,16.45 32.43,17.84 31.77,18.51 R40.2
  Top 0.254: R40.2 31.32,19.47 T7.1
!UART_POWER
  Top 0.152: T5.3 33.64,17.35 36.33,17.35 36.95,17.97 T4.1 37.65,20.02 R33.2
+3V3  (via drill 0.3, 0.35)
  Top 0.152: IC2.44 28,8.52 27.86,8.38 27.33,8.38 | v25.6,18.41 25.3,18.11 R7.1 | C21.2 15.01,16.94 | IC2.36 29.7,13.78 C4.2 28.43,14.54 v28.37,14.61 | L1.1 31.05,1.15 v30.66,0.76 | IC2.17 36.56,8.52 v36.78,8.3 | C21.2 15.75,16.48 C17.2 16.5,16.22 16.5,14.53 16.56,14.47 | R9.2 11.53,18.11 12.42,17.22 C21.2 | R16.2 16.56,14.47 | 16.56,14.47 15.94,14.47 v15.8,14.61 | T1.5 21,12.57
  Top 0.18: T1.5 21.08,11.4 21.07,11.39
  Top 0.254: 21.33,11.3 R12.2 21.07,11.39 20.97,11.39 v20.62,11.05 | C6.2 27.33,8.38 27.33,7.72 27.1,7.49 26.18,7.49 24.79,8.69 R5.1 24.56,8.71 24.56,9.4 v24.43,9.53 | R13.2 19.45,17.04 18.34,18.16 v18.21,18.16 | 29.7,13.72 IC2.36 | 29.01,14.54 29,14.54 C4.2
  Top 0.305: v38.37,6.73 38.4,6.73
  Route15 0.152: v25.6,18.41 25.58,18.41 | v36.78,8.3 36.73,8.26 36.63,8.26
  Route15 0.254: 28.24,14.48 v28.37,14.61 | v20.62,11.05 20.5,11.05 | v24.43,9.53 24.56,9.53
  Bottom 0.152: 35.86,18.16 35.86,18.15 | SD1.VCC 15.73,14.55 v15.8,14.61 | v30.66,0.76 31.55,0.76 32.75,1.97 J16.1-VCC | 30.59,18.67 v28.24,18.67 27.99,18.41 | 30.59,18.67 30.59,18.16 D12.2 | 30.59,18.67 33.18,18.67 | 33.18,18.67 D11.2 | 33.18,18.67 35.35,18.67 35.86,18.15 | D10.2 35.86,18.15
  Bottom 0.18: D9.2 27.99,18.41 | C22.2 33.65,17.66 D11.2
  Bottom 0.254: v18.21,18.16 18.24,18.13 R18.1 18.17,18.51 18.17,19.21 T2.2 | IC5.20 24.43,10.33 v24.43,9.53
  Bottom 0.305: IC6.2 41.43,4.8 C7.2 40.28,7.2 C9.2 39.87,7.42 D6.C 38.46,6.64 v38.37,6.73
  pour Route15: 0.05,0 46.05,0 46.05,28 0.05,28
+5V  (via drill 0.35)
  Top 0.152: v27.35,21.59 27.35,16.61 D1.1 | v35.99,20.77 36.45,21.22 T4.2 37.14,21.02 R33.1 38.97,21.02 v39.36,20.64 | J2.2 12.95,14.53 11.86,15.62 11.82,15.62 v11.76,15.56 | 33.07,20.27 T7.2 33.22,20.35 v33.07,20.21 33.07,20.27
  Top 0.254: T7.2 33.22,19.47 R40.1
  Route2 0.152: v41.83,11.56 41.83,17.84 39.36,20.32 v39.36,20.64
  Route15 0.152: v35.99,20.77 33.63,20.77 | 33.63,20.77 32.5,20.77 31.35,21.91 27.67,21.91 v27.35,21.59 27.35,21.34 26.97,20.95 22.26,20.95 21.99,20.68 13.3,20.68 11.76,19.14 v11.76,15.56 | 33.63,20.77 v33.07,20.21
  Bottom 0.152: J5.2 27.49,21.85 27.35,21.72 v27.35,21.59 | C3.2 37.31,15.41 38.4,15.41
  Bottom 0.254: C2.2 38.48,13.45 F1.2
  Bottom 0.305: 38.02,15.41 38.4,15.41 F1.2 | C1.2 40.34,2.39 IC6.3 42.96,2.39 43.66,3.1 43.66,7.87 44.62,8.83 44.62,11.31 44.37,11.56 v41.83,11.56 40.34,11.56 39.91,11.99 39.12,11.99 38.66,12.45 38.66,13.28 C2.2
CC1
  Top 0.18: J1.A5 37.24,12.75 R46.1
CC2
  Top 0.152: J1.B5 37.58,15.75 R47.1
D0_SW  (via drill 0.35)
  Top 0.152: IC2.29 33.26,12.73 33.26,14.26 v33.34,14.34 | R2.1 41.21,24.65 v41.2,24.64
  Route15 0.152: v41.2,24.64 41.2,21.14 39.4,19.35 38.23,19.35 35.05,16.18 35.05,15.84 34.34,15.13 34,15.13 33.34,14.47 v33.34,14.34
D1_IO1  (via drill 0.35)
  Top 0.152: IC2.9 33.71,5.86 33.71,4.88 33.96,4.63 v33.96,3.68
  Route2 0.152: v33.96,3.68 33.31,3.68 29.83,7.16 29.83,15.76 29.49,16.1 29.49,16.86 29.51,16.88 29.51,19.75 v29.32,19.94
  Bottom 0.152: R31.1 28.74,20.4 D9.3 v29.32,19.93 v29.32,19.94
D2_IO2  (via drill 0.35)
  Top 0.152: IC2.10 34.21,5.86 34.21,5.21 34.44,4.98 v34.44,4.94
  Route2 0.152: v34.44,4.94 34.44,5.26 31.16,8.53 31.16,19.36 v30.34,20.19
  Bottom 0.152: R30.1 31.32,20 | 31.32,20 D12.3 | v30.34,20.19 31.13,20.19 31.32,20
D3_IO3  (via drill 0.35)
  Top 0.152: 23.74,0.83 v23.61,0.83 22.53,0.83 21,2.35 21,4.7 18.72,6.99 R11.2 | IC2.11 34.7,5.46 34.99,5.17 34.99,4.5 34.52,4.02 34.52,3.45 33.96,2.89 v33.96,2.16
  Route15 0.152: v33.96,2.16 31.79,2.16 31.51,1.88 24.73,1.88 23.67,0.83 v23.61,0.83
D6_IO6  (via drill 0.35)
  Top 0.152: IC2.3 30.7,5.04 30.96,4.78 v30.97,4.78 | v26.39,3.94 26.28,4.05 R26.2
  Route2 0.152: v30.97,4.78 27.23,4.78 v26.39,3.94
D7_STATUS_RED  (via drill 0.3)
  Top 0.152: IC2.39 28.33,11.02 v28.2,11.15 | v41.07,0.71 41.07,1.23 R3.1
  Route15 0.152: v28.2,11.15 35.22,11.15 36.26,10.11 36.26,9.74 36.59,9.41 36.95,9.41 37.46,8.9 38.9,8.9 41.07,6.73 v41.07,0.71
D8_STATUS_GREEN  (via drill 0.3)
  Top 0.152: IC2.41 28.33,10.02 v28.19,9.88 | R4.1 v39.55,0.71 | v39.55,0.71
  Route15 0.152: v39.55,0.71 39.55,3.05 34.85,7.75 30.32,7.75 v28.19,9.88
D9_UART_PWR  (via drill 0.3)
  Top 0.152: T5.5 31.59,16.61 R32.1 30.71,16.64 v30.02,16.64 | IC2.47 28.53,7.02 v27.99,6.48
  Bottom 0.152: v27.99,6.48 28.88,7.37 28.88,11.23 26.95,13.16 26.95,14.21 26.97,14.24 26.97,15.3 28.31,16.64 v30.02,16.64
D10_TX1  (via drill 0.3)
  Top 0.152: IC2.31 32.07,12.8 32.07,13.93 32.51,14.36 v32.51,14.49
  Route15 0.152: v32.51,14.49 32.25,14.74 32.25,16.23 35.29,19.28 v35.61,19.28
  Bottom 0.152: 37.02,20.82 R24.1 37.28,20.57 D10.3 36.27,19.93 v35.61,19.28
D11_RX1  (via drill 0.3)
  Top 0.152: IC2.32 v31.7,14.46 arc90 v31.7,14.46
  Route2 0.152: v31.7,14.46 31.7,16.54 33.77,18.61 v33.77,19.28
  Bottom 0.152: v33.77,19.28 33.93,19.44 D11.3 33.63,20.23 33.63,20.44 33.15,20.91 R25.1
D14_I2C_PWR  (via drill 0.35)
  Top 0.152: T5.2 34.02,16.73 34.27,16.47 34.35,16.52 | 34.35,16.52 R37.1 | R38.2 T6.2 35.99,2.25 | 35.99,2.25 T6.5 | 36.66,9.56 36.75,9.65 | 36.62,9.78 v36.82,9.97 | v34.49,16.07 34.35,16.21 34.35,16.52 | 37.39,6.16 36.82,5.59 36.63,5.59 36.56,5.53 R39.2 36.56,3.81 35.99,3.24 35.99,2.25
  Top 0.18: 36.66,9.56 37.39,8.83 37.39,6.16 | 36.75,9.65 36.62,9.78 36.38,10.02 IC2.20
  Bottom 0.152: v36.82,9.97 36.82,10.03 37.51,10.73 37.51,14.06 36.39,15.19 35.66,15.19 34.78,16.07 v34.49,16.07
D15_SDA
  Top 0.152: T6.4 35.19,3.09 35.25,3.15 35.56,3.47 R39.1 35.85,4.35 IC2.13
D16_SCL  (via drill 0.35)
  Top 0.152: R38.1 36.96,1.25 36.72,1.49 | T6.1 36.81,1.58 36.72,1.49 | IC2.14 36.59,7.02 36.74,6.87 v36.76,6.87 | v36.63,0.74 36.63,1.4 36.72,1.49
  Bottom 0.152: v36.76,6.87 36.76,4.83 34.63,2.71 34.63,1.11 35.14,0.61 36.5,0.61 v36.63,0.74
D19_MOSI  (via drill 0.35)
  Top 0.152: IC2.25 v36.04,13.51 v36.05,13.51
  Route2 0.152: v36.05,13.51 v36.05,13.5 | v16.94,12.45 19.79,12.45 20.47,11.77 27.31,11.77 28.95,13.41 v28.95,13.64
  Bottom 0.152: IC5.13 22.42,14.88 19.82,12.28 IC5.4 17.12,12.28 v16.94,12.45 | v36.05,13.51 35.24,12.7 29.89,12.7 v28.95,13.64
D20_SCK  (via drill 0.35)
  Top 0.152: IC2.26 34.7,13.19 v35.16,13.65
  Route2 0.152: v27.54,14.97 27.4,14.97 25.92,13.48 23.07,13.48 22.98,13.39 v22.15,13.39 22.15,13.98 22.06,14.07 22.06,14.89 v21.83,15.12
  Bottom 0.152: v35.16,13.65 35.08,13.65 34.48,13.05 31.45,13.05 29.26,15.24 27.82,15.24 v27.54,14.97 | IC5.15 22.16,13.58 | 22.15,13.59 22.16,13.58 | IC5.6 19.28,13.58 20.75,15.05 21.76,15.05 v21.83,15.12 | v22.15,13.39 22.15,13.57 22.16,13.58
D21_MISO  (via drill 0.35)
  Top 0.152: IC2.28 33.7,13.9 v34.21,14.41
  Route15 0.152: v34.21,14.41 34.21,14.35 32.69,12.83 26.34,12.83 23.26,15.91 v22.53,15.91
  Bottom 0.152: IC5.9 19.54,15.53 19.92,15.91 v22.53,15.91 22.91,15.53 IC5.12
D22_!XB1_PWR  (via drill 0.3)
  Top 0.152: v26.72,5.59 26.78,5.65 28.31,5.65 29.05,6.39 IC2.48
  Bottom 0.152: T2.1 20,18.58 R18.2 20.12,17.56 25.54,17.56 26.02,17.08 26.02,11 25.63,10.61 25.63,10.11 26.28,9.47 26.28,6.03 v26.72,5.59
D23_CS_XB1  (via drill 0.3)
  Top 0.152: T1.1 v22.59,14.29 | v34.26,13.58 34.33,13.52 34.33,12.8 IC2.27
  Route15 0.152: v22.59,14.29 24.24,14.29 26.21,12.32 33.13,12.32 34.28,13.46 34.28,13.57 v34.26,13.58
D24_INT_XB1  (via drill 0.35)
  Top 0.152: v32.69,13.65 IC2.30
  Bottom 0.152: R15.2 22.7,22.48 23.01,22.48 24.6,20.9 26.52,20.9 27.04,20.38 27.04,17.72 27.59,17.17 30.24,17.17 31.16,16.25 31.16,14.1 31.61,13.65 v32.69,13.65
D25_TX_XB1  (via drill 0.3)
  Top 0.152: IC2.37 28.5,12.57 28.5,13.3 28.39,13.41 28.39,13.44 28.37,13.46 v28.12,13.46 | v13.89,6.99 12.78,6.99 R8.1
  Route2 0.152: v28.12,13.46 27.04,12.38 23.9,12.38 23.64,12.12 22.94,12.12 22.57,12.5 20.18,12.5 19.6,13.07 15.6,13.07 14.3,11.77 14.3,11.46 13.89,11.06 v13.89,6.99
D26_RX_XB1  (via drill 0.3)
  Top 0.152: IC2.38 29.03,11.53 28.7,11.53 28.17,12.06 28.17,12.5 27.35,13.32 27.35,13.97 27.38,13.99 v27.48,13.99 | v12.5,10.67 12.55,10.61 R10.1
  Route2 0.152: v12.5,10.67 12.85,11.03 12.85,12.67 13.57,13.38 19.73,13.38 20.3,12.8 22.69,12.8 23.07,12.42 23.51,12.42 23.79,12.7 26.19,12.7 v27.48,13.99
D28_CS_XB2  (via drill 0.35)
  Top 0.152: T1.4 20.33,12.18 v19.78,11.64 | v36.78,10.88 36.48,11.18 36.48,11.22 36.18,11.52 IC2.23
  Route15 0.152: v19.78,11.64 19.83,11.68 35.98,11.68 v36.78,10.88
D29_INT_XB2  (via drill 0.35)
  Top 0.152: R17.2 13.57,17.97 v13.77,17.78 | v36.31,12.57 36.31,12.48 IC2.24
  Route15 0.152: v13.77,17.78 19.35,12.19 25.91,12.19 26.09,12.01 33.4,12.01 33.96,12.57 v36.31,12.57
GND  (via drill 0.3)
  Top 0.152: J12.1 29.5,22.99 29.49,22.98 C24.1 29.5,21.21 v30.02,21.21 | J13.1 38.13,23.98 38.15,24 v38.15,24.26 | IC2.5 31.71,5.86 31.71,5.1 31.89,4.92 C8.1 | v34.32,23.05 34.38,23.11 34.47,23.11 | SW1.4 v44.3,22.86 SW1.3 | v41.77,19.56 R1.1 | IC2.42 30.4,9.53 | 30.4,9.53 30.53,9.53 30.78,9.27 IC2.TP | C6.1 26.33,9.27 | 26.33,9.27 C13.1 | 26.33,9.27 26.2,9.4 v25.32,9.4 | D7.C 21.85,21.12 v21.77,21.21 | C12.1 25.75,20.32 v26.34,20.32 | D5.3 36.15,14.64 v36.17,14.66 | IC2.18 34.46,9.02 34.21,9.27 IC2.TP | 30.4,12.06 30.4,9.53 | IC2.TP 32.45,8.24 31.7,7.49 | R37.2 35.81,16.52 R47.2
  Top 0.18: T5.4 30.86,17.48 R32.2 | C4.1 arc90 30.2,14.29 IC2.35 30.2,12.27 arc90 30.4,12.06 | J1.GND2 37.81,10.75 37.23,11.34 R46.2 | C15.1 C14.2 | C10.1 31.3,2.4 v31.29,2.41 | IC2.5 31.7,7.49 31.7,8.28 31.93,8.51 | v25.58,23.11 25.7,23.11
  Top 0.254: D3.C v40.18,5.75 D2.C | SW2.2 v42.92,4.95 SW2.1 | v15.8,12.38 15.67,12.38
  Route2 0.152: v30.02,21.21 29.51,21.21 | v32.31,27.29 32.31,26.92 | v38.15,24.26 38.28,24.26
  Bottom 0.152: D16.C 32.3,27.51 32.31,27.52 v32.31,27.29 | J4.1 34.48,23 34.47,22.99 34.38,22.99 v34.32,23.05 | R19.2 18.05,8.86 v18.08,8.89 | SD1.GND@1 11.2,10.5 SD1.SW2 11.2,20.29 11.86,20.95 13.26,20.95 13.51,20.7 13.51,19.51 SD1.GND@2 | v36.17,14.66 35.66,14.66 35.61,14.61 | IC5.10 17.44,16.18 v17.38,16.13 | 36.12,16 36.12,16.64 35.67,17.08 C22.1 34.68,17.11 D11.1
  Bottom 0.18: J5.1 26.38,23.11 v25.58,23.11
  Bottom 0.254: v15.8,12.38 15.38,12.38 SD1.GND
  other vias: 22.97,7.87 3.1,26.8 3.22,4.45 44.05,26.48 42.72,1.02 40.56,10.54 40.56,17.4 30.53,10.54 34.47,10.54 30.66,7.11 34.47,7.11 6.15,1.4 37.01,17.08 6.21,23.24 14.08,1.14 18.15,1.21 12.11,21.21 11.48,14.54 12.43,16.57 32.88,16 28.62,0.83
  pour Route2: 0.05,0 46.05,0 46.05,28 0.05,28
  pour Top: 0.05,0 46.05,0 46.05,28 0.05,28
  pour Bottom: 0.05,0 46.05,0 46.05,28 0.05,28
I2C_SCL  (via drill 0.3)
  Top 0.152: T6.6 35.12,1.52 v35.61,1.52 | R41.1 38.47,3.24 v38.4,3.17 | J12.4 26.49,21.87 | 26.47,21.84 v26.47,21.74 | v34.32,22.24 35.08,23 J13.4
  Top 0.254: 26.49,21.87 26.47,21.84
  Route2 0.152: 37.94,22.24 38.54,22.24 39.91,20.87 39.91,20.27 42.3,17.88 42.28,17.85 42.28,12.06 42.4,11.94 42.4,11.11 42.3,11.01 42.3,6.69
  Route2 0.18: v38.4,3.17 38.78,3.17 42.3,6.69 | v34.32,22.24 37.94,22.24
  Bottom 0.152: v35.61,1.52 37.26,3.17 v38.4,3.17 | v26.47,21.74 25.7,21.74 24.75,22.7 24.75,24.07 26.15,25.46 30.08,25.46 30.91,24.64 30.91,23.32 32.26,21.97 34.05,21.97 v34.32,22.24
I2C_SDA  (via drill 0.3)
  Top 0.152: T6.3 37.51,3.62 R42.1 | v36.12,24.28 36.12,23.01 J13.3 | J12.3 27.49,24.27 v27.61,24.38
  Top 0.18: R42.1 37.51,3.78 v37.48,3.75
  Route2 0.152: v27.61,24.38 32.82,24.38 | 32.82,24.38 35.86,24.38 36.12,24.13 v36.12,24.28 | 32.82,24.38 32.82,22.35 34.96,20.21 36.22,20.21 36.33,20.32 38.84,20.32 41.53,17.64 41.53,12.04 41.28,11.79 41.28,11.33 41.55,11.06 41.55,8.26
  Route2 0.18: 41.55,8.26 37.48,4.19 v37.48,3.75
I2C_VCC
  Top 0.152: 32.57,23.37 33.32,23.37 34.85,24.89 36.63,24.89 37.13,24.39 J13.2 37.13,22.04 37.26,21.91 39.74,21.91 41.56,20.09 41.99,20.09 42.14,19.94 43.99,19.94 44.5,19.43 44.5,9.27 43.74,8.51 38.91,8.51 37.83,7.43 37.83,5.14 37.9,5.07 | 32.57,23.37 32.32,23.37 32.27,23.32 | 32.57,23.37 R43.2 | T7.3 32.27,23.32 | J12.2 28.49,24.12 28.75,24.38 30.53,24.38 31.59,23.32 32.27,23.32
  Top 0.18: R41.2 37.9,5.07 R42.2
  Top 0.254: C24.2 J12.2
IO1
  Bottom 0.152: R31.2 J5.3
IO2
  Bottom 0.152: J5.4 30.1,23 R30.2
MCU_CS_XBEE1  (via drill 0.35)
  Top 0.152: T1.6 22.33,11.99 R12.1 22.27,11.34 v22.27,10.54
  Bottom 0.152: IC5.2 IC5.1 22.06,10.33 v22.27,10.54
MCU_CS_XBEE2  (via drill 0.35)
  Top 0.152: R13.1 20.33,15.27 T1.3 20.33,14.11 18.92,12.7 18.92,10.02 v18.53,9.62
  Bottom 0.152: IC5.17 23.76,12.28 23.42,11.94 23.42,11.18 23.61,10.98 23.67,10.98 | IC5.19 23.67,10.98 | 23.67,10.98 22.42,9.72 19.44,9.72 19.34,9.62 v18.53,9.62
N$1
  Top 0.152: C14.1 27.22,3.39 Q1.2 IC2.1
N$2
  Top 0.152: C15.2 29.97,2.01 Q1.1 30.2,3.87 IC2.2
N$3
  Top 0.152: D2.A 40.8,2.5 R3.2
N$4  (via drill 0.3)
  Top 0.152: v12.56,17.84 12.57,17.86 R17.1 12.51,18.89 12.04,19.36 R9.1
  Bottom 0.152: SD1.SW1 12.25,18.03 12.5,17.78 v12.56,17.84
N$5
  Top 0.152: D7.A 22.17,19.62 21.79,19.24 R22.1
N$6
  Top 0.152: D1.4 26.46,10.92 25.95,10.92 25.12,10.1 24.18,10.1 23.74,9.65 23.74,5.79 24.85,4.68 25.23,4.68 R26.1
N$7
  Top 0.152: J2.3 14.42,13.44 14.09,13.44 13.19,12.55 13.19,11.43 14.13,10.5 T3.3
N$8
  Top 0.152: R43.1 D20.A
N$9
  Bottom 0.152: D16.A R34.1
N$12
  Top 0.152: D3.A R4.2
N$13
  Top 0.152: R6.2 41.87,8.13 44.25,8.13 44.42,7.95 SW2.4 SW2.3
RST  (via drill 0.3, 0.35)
  Top 0.152: C12.2 24.62,20.19 R7.2 24.62,19.05 25.83,19.05 v26.08,19.3 | v26.17,10.39 26.19,10.41
  Top 0.18: R6.1 39.48,7.43 39.29,7.62 v39.04,7.62 | IC2.40 28.03,10.52 27.91,10.39 v26.17,10.39
  Bottom 0.152: v39.04,7.62 38.91,7.75 30.53,7.75 28.12,5.33 27.41,5.33 27.35,5.33 | v26.17,10.39 26.17,10.71 26.34,10.88 26.34,19.05 v26.08,19.3
  Bottom 0.18: J16.3-RST 27.41,2.95 27.41,5.33 | 27.35,5.33 27.35,5.78 26.65,6.48 26.65,9.84 26.17,10.33 v26.17,10.39
RST_XB1  (via drill 0.3)
  Top 0.152: XBEE1.5 12.05,5.01 12.5,5.46 v12.62,5.46
  Bottom 0.152: v12.62,5.46 12.57,5.51 IC4.2
SHLD  (4 unrouted)
  Top 0.152: J1.S@1 40.04,19.34 R1.2
  Top 0.406: J1.S@3 43.15,18.27 J1.S@9 43.15,9.73 J1.S@7
  Bottom 0.406: J1.S@6 J1.S@7 | J1.S@1 J1.S@3
SW
  Top 0.152: SW1.2 SW1.1
  Top 0.254: R2.2 41.72,26.44 42.8,25.36 SW1.2
SW_FAN
  Top 0.152: T3.1 16.11,7.48 R20.2 R11.1
SWCLK  (via drill 0.3)
  Top 0.18: IC2.45 28.2,8.02 27.29,7.11 25.83,7.11 25.25,7.69 24.56,7.69 | R5.2 24.56,7.69 | v24.56,6.99 24.56,7.69
  Bottom 0.18: J16.4-SWDCLK 25.13,2.83 25.14,2.83 25.14,3.14 24.94,3.34 24.94,6.6 v24.56,6.99
SWDIO  (via drill 0.3)
  Top 0.18: IC2.46 28.2,7.52 26.9,6.22 24.43,6.22 v24.31,6.1
  Bottom 0.18: v24.31,6.1 24.08,6.1 22.59,4.6 J16.5-SWDIO
UART_RX1
  Bottom 0.152: J4.3 37.16,22.96 37.16,22.7 35.78,21.32 35.76,21.32 35.55,21.11 R25.2
UART_TX1
  Bottom 0.152: 38.13,22.64 J4.4 38.28,22.85 R24.2
UART_VCC  (via drill 0.3)
  Top 0.152: v35.04,21.68 35.04,20.56 T4.3 34.75,19.06 C23.2
  Bottom 0.152: R34.2 34.15,23.63 34.5,23.98 35.49,23.98 36.16,23.3 36.16,23.04 J4.2 36.13,22.61 35.1,21.59 35.04,21.65 v35.04,21.68
USB_D_N
  Top 0.152: 37.51,14.18 37.89,14.18 | 37.81,13.25 37.67,13.38 37.64,13.38 37.51,13.51 37.51,14.18 | 37.51,14.18 37.51,14.24 D5.1 arc-90 36.8,14.1 35.86,14.1 arc-90 34.91,15.05 31.67,15.05 arc90 31.1,14.48 31.1,12.77 IC2.33
  Top 0.18: J1.A7 38.12,14.25 38.04,14.33 37.89,14.18 | J1.B7 37.81,13.25
USB_D_P
  Top 0.152: J1.B6 39.15,14.75 39.55,14.35 39.55,13.97 39.29,13.72 38.43,13.72 | IC2.34 30.7,14.44 arc-90 31.69,15.43 36.56,15.43 arc-90 D5.2 37.01,14.99 37.01,14.99 arc90 37.26,14.73 38.38,14.73
  Top 0.18: 38.43,13.72 J1.A6 | 38.38,14.73 J1.B6
VBUS  (via drill 0.3)
  Top 0.254: J1.VBUS2 38.78,11.55 39.2,11.96 39.42,11.96 40.56,13.11 40.56,14.73 | J1.VBUS 38.78,16.45 39.2,16.04 39.51,16.04 40.56,14.99 40.56,14.73 | 40.56,14.73 v40.94,14.73
  Bottom 0.254: v40.94,14.73 40.94,14.85 F1.1
VCCANA
  Top 0.152: L1.2 33.13,2.04 C10.2 C11.2 32.77,4.21 C8.2 32.66,4.57 32.66,4.83 32.2,5.29 IC2.6
VCCCORE
  Top 0.152: IC2.43 27.71,9.02 C13.2
XB1_CS  (via drill 0.35)
  Top 0.152: XBEE1.17 11.52,26.5 13.55,24.47 R14.1 13.97,21.08 13.97,21.07 15.99,19.05 v16.81,19.05
  Bottom 0.152: v16.81,19.05 16.81,18.81 18.42,17.2 25.32,17.2 25.7,16.81 25.7,11.94 25.39,11.63 IC5.18
XB1_MISO  (via drill 0.3)
  Top 0.152: XBEE1.4 10.05,5.38 10.9,6.22 10.9,7.16 11.5,7.77 12.95,7.77 14.45,9.27 16.98,9.27 17.58,9.86 17.58,14.86 v17.45,14.99
  Bottom 0.152: v17.45,14.99 17.58,14.86 18.52,14.86 IC5.8
XB1_MOSI  (via drill 0.3)
  Top 0.152: XBEE1.11 22.05,26.37 23.55,24.88 23.55,18.95 23.16,18.57 23.16,13.08 v23.29,12.95
  Bottom 0.152: v23.29,12.95 24.52,12.95 IC5.16
XB1_RX
  Top 0.152: R8.2 11.35,6.55 11.35,3.68 9.32,1.65 8.2,1.65 XBEE1.3
XB1_SCK  (via drill 0.35)
  Top 0.152: XBEE1.18 9.44,23.5 9.57,23.37 v9.7,23.37
  Bottom 0.152: v9.7,23.37 14.27,23.37 15.9,21.75 15.9,19.09 18.09,16.89 25.2,16.89 25.39,16.7 25.39,14.23 IC5.14
XB1_TX
  Top 0.152: R10.2 10.59,7.42 10.59,6.35 10.08,5.84 9.57,5.84 8.23,4.5 XBEE1.2
XB1_VCC  (via drill 0.3, 0.35)
  Top 0.152: R14.2 18.17,21.5 18.21,21.46 v18.27,21.53 20.31,21.53 21.13,20.7 21.13,18.28 R22.2 21.79,16.28 21.08,15.57 T1.2 21.08,13.66 20.75,13.34 19.99,13.34 19.23,12.57 v19.23,9.02
  Top 0.254: XBEE1.1 5.47,2.92 v9.07,2.92
  Bottom 0.152: 14.78,5.37 IC4.3 | v18.27,21.53 19,21.53 T2.3 | v19.23,9.02 19.82,9.02 C16.2
  Bottom 0.254: v9.07,2.92 13.26,2.92 14.78,4.45 14.78,5.37 | IC4.3 16.65,7.25 R19.1 19.85,7.25 C18.2 | C20.2 20.1,5.2 C18.2 | C16.2 20.09,7.01 C18.2
XB2_CS  (via drill 0.3)
  Top 0.152: 13.83,11.62 v13.77,11.68 16.31,11.68 | 16.31,11.68 v16.56,11.68 | R16.1 16.6,13.02 16.32,12.75 16.32,12.61 16.33,12.6 16.33,11.71 16.31,11.68
  Bottom 0.152: v16.56,11.68 18.49,11.68 IC5.3 | SD1.CS 14.01,16.75 13.77,16.51 v13.77,11.68
XB2_MISO
  Bottom 0.152: SD1.MISO 15.16,11.06 13.25,11.06 13.19,11.11 13.19,16.37 14.47,17.65 14.47,18.25 14.62,18.4 16.08,18.4 17.9,16.58 24.14,16.58 IC5.11
XB2_MOSI
  Bottom 0.152: IC5.7 17.44,14.23 16.02,15.65 SD1.MOSI
XB2_SCK
  Bottom 0.152: SD1.SCK 15.36,13.46 16.72,13.46 17.25,12.93 IC5.5
XBEE1_CTS/IRQ  (via drill 0.3)
  Top 0.152: XBEE1.12 21.38,23.5 21.64,23.24 v21.64,23.11
  Bottom 0.152: v21.64,23.11 21.67,23.08 R15.1

### Text on the board
tPlace: SW1 | Fan | I2C | Xbee | Reset
bPlace: IO1-2 | UART | senseBox | MCU mini V1.1
Reference: Silkscreen: 21 tPlace + 22 bPlace
tDocu: SDO1 | SDO2